# Altium schematic sheet MCU.SchDoc
size C; SheetNumber: 3; SheetTotal: 4
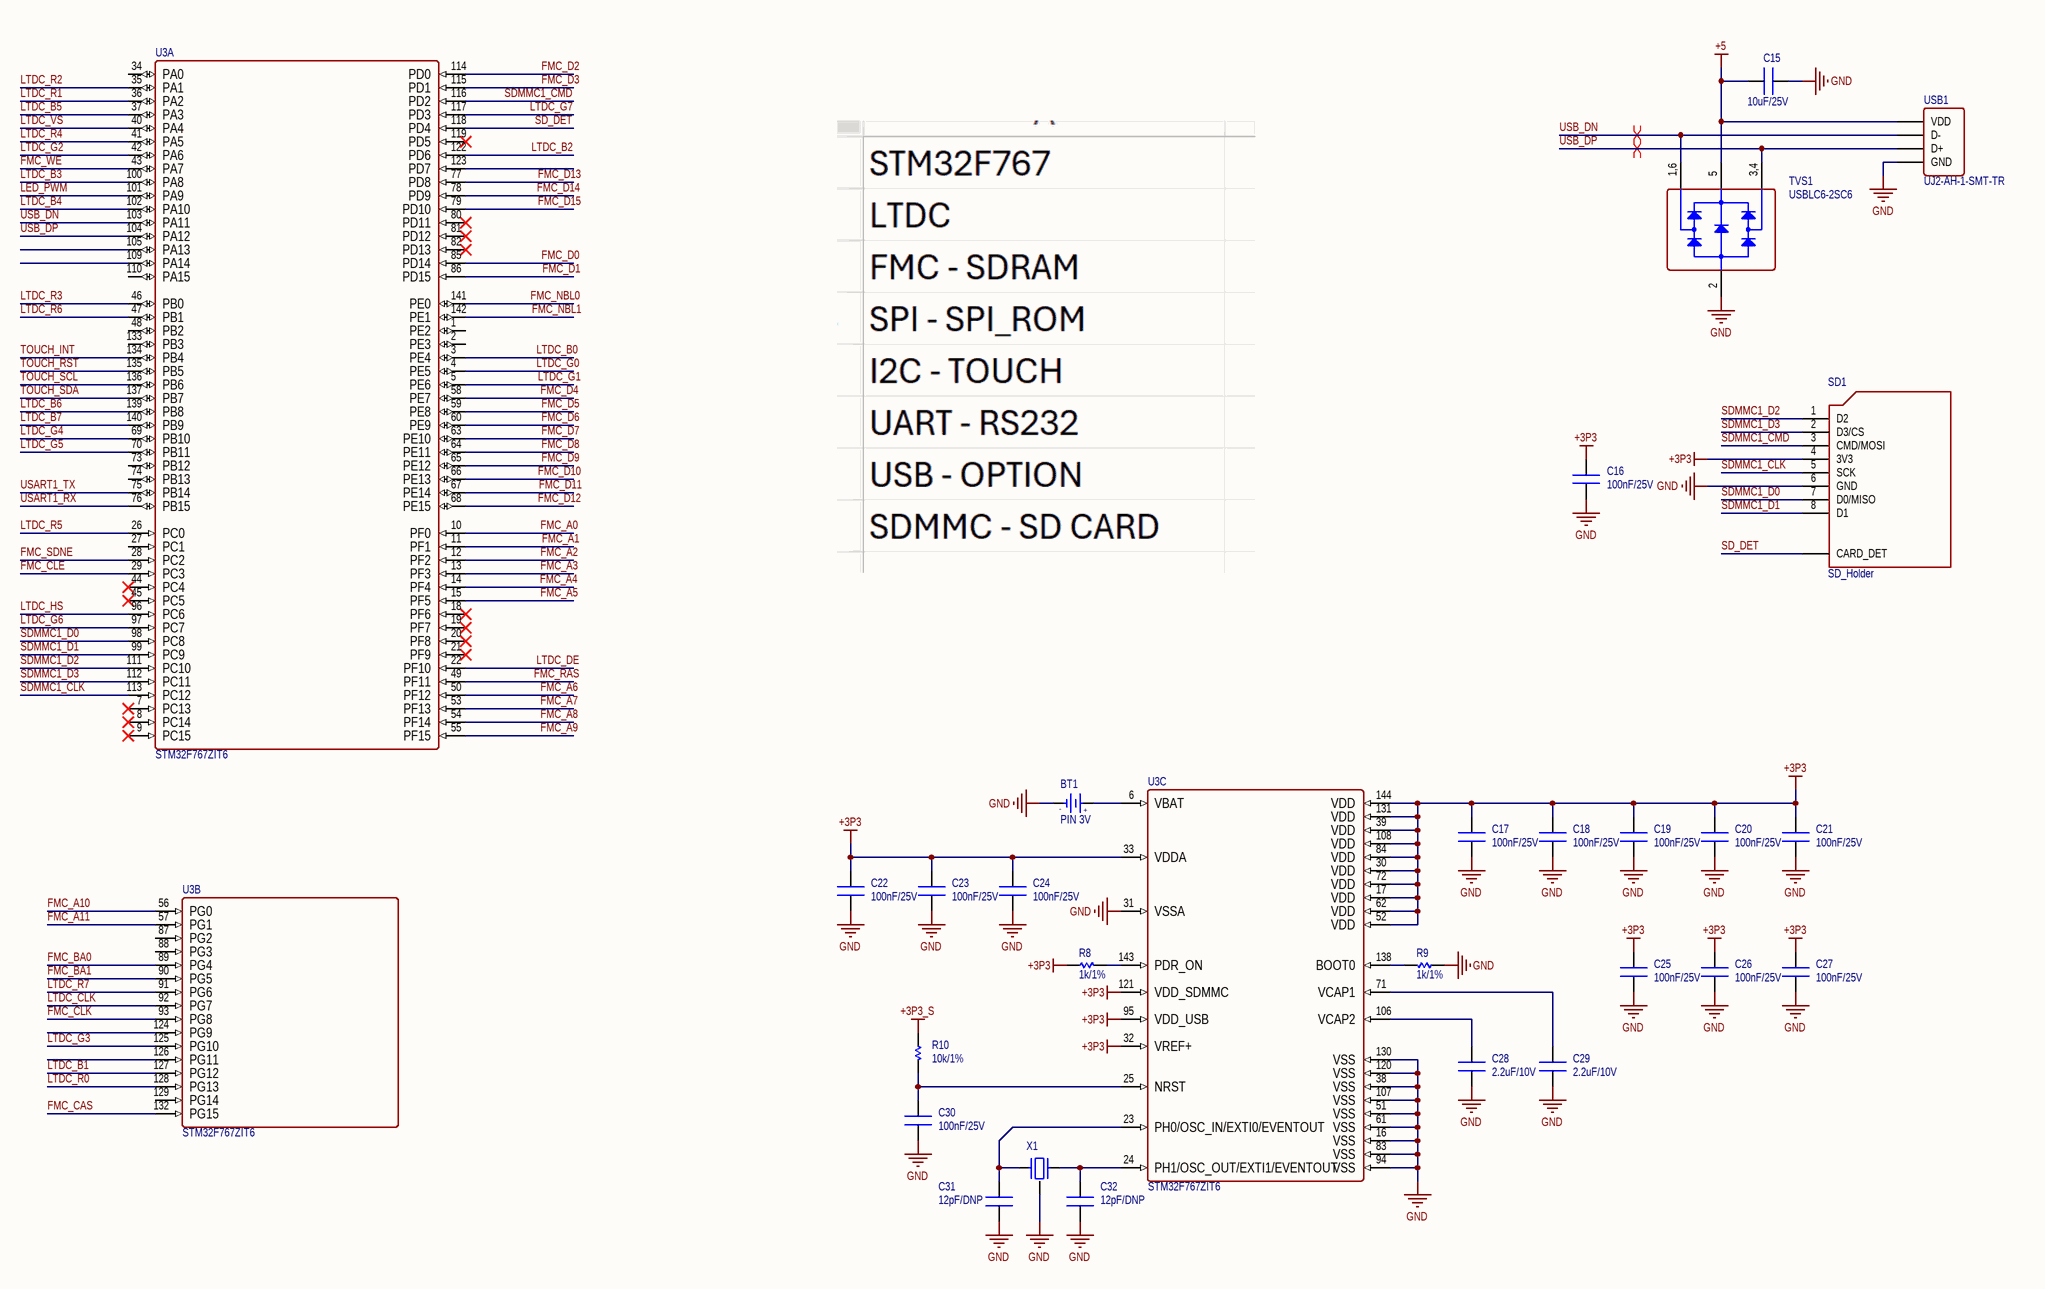
[diagram p0: MCU.SchDoc]

## Parts
BT1  PIN 3V  [PIN CR1220-SMD]
C15  10uF/25V  [CN-SMD-0603]
C16  100nF/25V  [CN-SMD-0603]
C17  100nF/25V  [CN-SMD-0603]
C18  100nF/25V  [CN-SMD-0603]
C19  100nF/25V  [CN-SMD-0603]
C20  100nF/25V  [CN-SMD-0603]
C21  100nF/25V  [CN-SMD-0603]
C22  100nF/25V  [CN-SMD-0603]
C23  100nF/25V  [CN-SMD-0603]
C24  100nF/25V  [CN-SMD-0603]
C25  100nF/25V  [CN-SMD-0603]
C26  100nF/25V  [CN-SMD-0603]
C27  100nF/25V  [CN-SMD-0603]
C28  2.2uF/10V  [CN-SMD-0603]
C29  2.2uF/10V  [CN-SMD-0603]
C30  100nF/25V  [CN-SMD-0603]
C31  12pF/DNP  [CN-SMD-0603]
C32  12pF/DNP  [CN-SMD-0603]
R8  1k/1%  [RES-SMD-0603]
R9  1k/1%  [RES-SMD-0603]
R10  10k/1%  [RES-SMD-0603]
SD1  SD_Holder  [SD Socket]
TVS1  USBLC6-2SC6  [SOT23-6]
U3  STM32F767ZIT6  [LQFP144]  (parts A,B,C of 3)
USB1  UJ2-AH-1-SMT-TR  [USB-C4]
X1  TSX-3225 25.0000MF10P-C0  [XT4-16.000MHz-4_V]  (value not drawn)

## Nets
+3P3: C16.2 C17.2 C18.2 C19.2 C20.2 C21.2 C22.2 C23.2 C24.2 C25.2 C26.2 C27.2 R8.2 SD1.4(3V3) U3.17(VDD) U3.30(VDD) U3.32(VREF+) U3.33(VDDA) U3.39(VDD) U3.52(VDD) U3.62(VDD) U3.72(VDD) U3.84(VDD) U3.95(VDD_USB) U3.108(VDD) U3.121(VDD_SDMMC) U3.131(VDD) U3.144(VDD)
+3P3_S: R10.2
+5: C15.2 TVS1.5 USB1.1(VDD)
GND: BT1.2(GND) C15.1 C16.1 C17.1 C18.1 C19.1 C20.1 C21.1 C22.1 C23.1 C24.1 C25.1 C26.1 C27.1 C28.2 C29.2 C30.2 C31.1 C32.1 R9.2 SD1.6(GND) TVS1.2 U3.16(VSS) U3.31(VSSA) U3.38(VSS) U3.51(VSS) U3.61(VSS) U3.83(VSS) U3.94(VSS) U3.107(VSS) U3.120(VSS) U3.130(VSS) USB1.4(GND) X1.2,4(GND)
FMC_A0: U3.10(PF0)
FMC_A1: U3.11(PF1)
FMC_A2: U3.12(PF2)
FMC_A3: U3.13(PF3)
FMC_A4: U3.14(PF4)
FMC_A5: U3.15(PF5)
FMC_A6: U3.50(PF12)
FMC_A7: U3.53(PF13)
FMC_A8: U3.54(PF14)
FMC_A9: U3.55(PF15)
FMC_A10: U3.56(PG0)
FMC_A11: U3.57(PG1)
FMC_BA0: U3.89(PG4)
FMC_BA1: U3.90(PG5)
FMC_CAS: U3.132(PG15)
FMC_CLE: U3.29(PC3)
FMC_CLK: U3.93(PG8)
FMC_D0: U3.85(PD14)
FMC_D1: U3.86(PD15)
FMC_D2: U3.114(PD0)
FMC_D3: U3.115(PD1)
FMC_D4: U3.58(PE7)
FMC_D5: U3.59(PE8)
FMC_D6: U3.60(PE9)
FMC_D7: U3.63(PE10)
FMC_D8: U3.64(PE11)
FMC_D9: U3.65(PE12)
FMC_D10: U3.66(PE13)
FMC_D11: U3.67(PE14)
FMC_D12: U3.68(PE15)
FMC_D13: U3.77(PD8)
FMC_D14: U3.78(PD9)
FMC_D15: U3.79(PD10)
FMC_NBL0: U3.141(PE0)
FMC_NBL1: U3.142(PE1)
FMC_RAS: U3.49(PF11)
FMC_SDNE: U3.28(PC2)
FMC_WE: U3.43(PA7)
LED_PWM: U3.101(PA9)
LTDC_B0: U3.3(PE4)
LTDC_B1: U3.127(PG12)
LTDC_B2: U3.122(PD6)
LTDC_B3: U3.100(PA8)
LTDC_B4: U3.102(PA10)
LTDC_B5: U3.37(PA3)
LTDC_B6: U3.139(PB8)
LTDC_B7: U3.140(PB9)
LTDC_CLK: U3.92(PG7)
LTDC_DE: U3.22(PF10)
LTDC_G0: U3.4(PE5)
LTDC_G1: U3.5(PE6)
LTDC_G2: U3.42(PA6)
LTDC_G3: U3.125(PG10)
LTDC_G4: U3.69(PB10)
LTDC_G5: U3.70(PB11)
LTDC_G6: U3.97(PC7)
LTDC_G7: U3.117(PD3)
LTDC_HS: U3.96(PC6)
LTDC_R0: U3.128(PG13)
LTDC_R1: U3.36(PA2)
LTDC_R2: U3.35(PA1)
LTDC_R3: U3.46(PB0)
LTDC_R4: U3.41(PA5)
LTDC_R5: U3.26(PC0)
LTDC_R6: U3.47(PB1)
LTDC_R7: U3.91(PG6)
LTDC_VS: U3.40(PA4)
SD_DET: SD1.9(CARD_DET) U3.118(PD4)
SDMMC1_CLK: SD1.5(SCK) U3.113(PC12)
SDMMC1_CMD: SD1.3(CMD/MOSI) U3.116(PD2)
SDMMC1_D0: SD1.7(D0/MISO) U3.98(PC8)
SDMMC1_D1: SD1.8(D1) U3.99(PC9)
SDMMC1_D2: SD1.1(D2) U3.111(PC10)
SDMMC1_D3: SD1.2(D3/CS) U3.112(PC11)
TOUCH_INT: U3.134(PB4)
TOUCH_RST: U3.135(PB5)
TOUCH_SCL: U3.136(PB6)
TOUCH_SDA: U3.137(PB7)
USART1_RX: U3.76(PB15)
USART1_TX: U3.75(PB14)
USB_DN: TVS1.1,6(IO1) U3.103(PA11) USB1.2(D-)
USB_DP: TVS1.3,4(IO2) U3.104(PA12) USB1.3(D+)
NetBT1_1: BT1.1(+3V) U3.6(VBAT)
NetC28_1: C28.1 U3.106(VCAP2)
NetC29_1: C29.1 U3.71(VCAP1)
NetC30_1: C30.1 R10.1 U3.25(NRST)
NetC31_2: C31.2 U3.23(PH0/OSC_IN/EXTI0/EVENTOUT) X1.1
NetC32_2: C32.2 U3.24(PH1/OSC_OUT/EXTI1/EVENTOUT) X1.3
NetR8_1: R8.1 U3.143(PDR_ON)
NetR9_1: R9.1 U3.138(BOOT0)

Not connected (* = marked no-connect by the designer): U3 1(PE2) 2(PE3) 7(PC13)* 8(PC14)* 9(PC15)* 18(PF6)* 19(PF7)* 20(PF8)* 21(PF9)* 27(PC1) 34(PA0) 44(PC4)* 45(PC5)* 48(PB2) 73(PB12) 74(PB13) 80(PD11)* 81(PD12)* 82(PD13)* 87(PG2) 88(PG3) 105(PA13) 109(PA14) 110(PA15) 119(PD5)* 123(PD7) 124(PG9) 126(PG11) 129(PG14) 133(PB3)

## Layout directives
differential pair: USB_DN, USB_DP

## Notes on the sheet
- (in symbol PIN 3V) -; +

## Library data of the parts
BT1 = PIN 3V: 1056; PN: 1056
C15 = CN: 0603W106M250XD; PN: 0603W106M250XD
C16-C27 C30 = CN: CL10B104KA8NNNC; PN: CL10B104KA8NNNC
C28 C29 = CN: CL10B225KP8NNNC; PN: CL10B225KP8NNNC
C31 C32 = CN: CL10C120JB81PNC/DNP; PN: CL10C120JB81PNC/DNP
R8 R9 = Res-SMD: ERJ-3EKF1001V; Manufacturer: Generic Components; Class: Passive; PN: ERJ-3EKF1001V; Publisher: Altium Hobart Technology Centre
R10 = Res-SMD: ERJ-3EKF1002V; Manufacturer: Generic Components; Class: Passive; PN: ERJ-3EKF1002V; Publisher: Altium Hobart Technology Centre
TVS1 = USBLC6-2: PN: USBLC6-2SC6
U3 = STM32F767ZIT6: High-performance MCU based on Cortex-M7 core with DSP and double-precision FPU, up to 216 MHz CPU, up to 2 MB Flash, ART Accelerator and L1 cache for zero-wait execution.; PN: STM32F767ZIT6
USB1 = USB-4: Manufacturer: Würth Elektronik eiSos GmbH; PN: UJ2-AH-1-SMT-TR; ComponentLink1Description: Manufacturer; ComponentLink1URL: http://www.we-online.de; Created by: Christin Otto; Created Date: OCT-2014; ComponentLink2Description: Datasheet; ComponentLink2URL: http://www.we-online.de/katalog/media/pdf/8492121.pdf
X1 = XT4: PN: TSX-3225 25.0000MF10P-C0